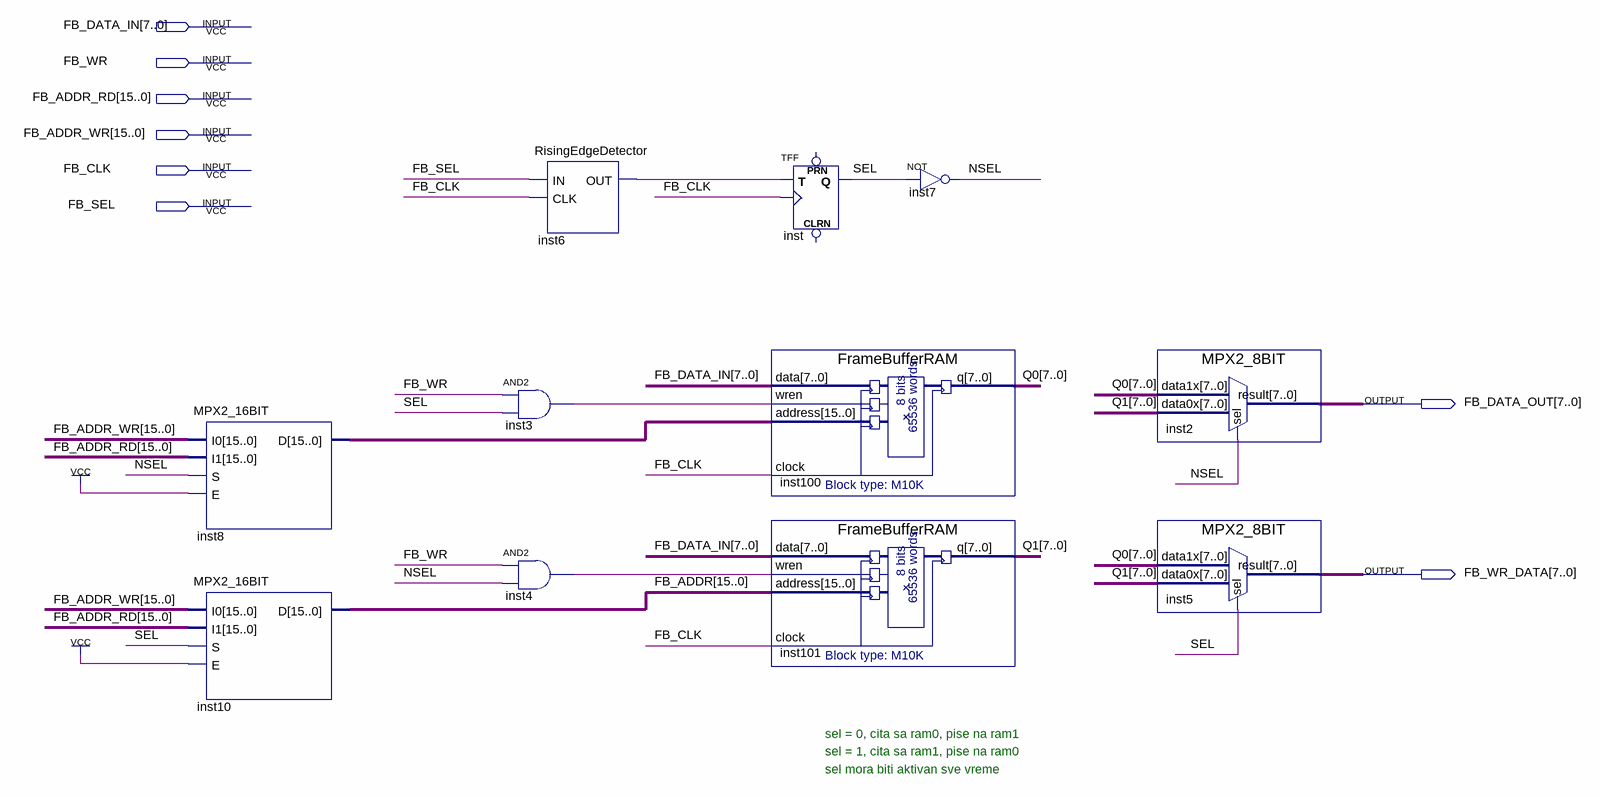
[diagram p0: schematic sheet]
// Quartus schematic FrameBufferWrapper.bdf as structural Verilog: 11 symbols, 8 pins
module FrameBufferWrapper (
  input  [7:0] FB_DATA_IN,
  input  FB_WR,
  input  [15:0] FB_ADDR_RD,
  input  [15:0] FB_ADDR_WR,
  input  FB_CLK,
  input  FB_SEL,
  output [7:0] FB_DATA_OUT,
  output [7:0] FB_WR_DATA
);

  wire inst3_out, inst4_out, inst6_out, NSEL, SEL;
  wire [7:0] Q0, Q1;
  wire [15:0] FB_ADDR, inst8_d;

  MPX2_16BIT inst8 (.I0(FB_ADDR_WR), .I1(FB_ADDR_RD), .S(NSEL), .E(1'b1), .D(inst8_d));
  MPX2_16BIT inst10 (.I0(FB_ADDR_WR), .I1(FB_ADDR_RD), .S(SEL), .E(1'b1), .D(FB_ADDR));
  and inst3 (inst3_out, FB_WR, SEL);
  and inst4 (inst4_out, FB_WR, NSEL);
  RisingEdgeDetector inst6 (.IN(FB_SEL), .CLK(FB_CLK), .OUT(inst6_out));
  TFF inst (.T(inst6_out), .CLK(FB_CLK), .Q(SEL));  // open: PRN, CLRN
  FrameBufferRAM inst100 (.data(FB_DATA_IN), .wren(inst3_out), .address(inst8_d), .clock(FB_CLK), .q(Q0));
  FrameBufferRAM inst101 (.data(FB_DATA_IN), .wren(inst4_out), .address(FB_ADDR), .clock(FB_CLK), .q(Q1));
  not inst7 (NSEL, SEL);
  MPX2_8BIT inst2 (.data1x(Q0), .data0x(Q1), .sel(NSEL), .result(FB_DATA_OUT));
  MPX2_8BIT inst5 (.data1x(Q0), .data0x(Q1), .sel(SEL), .result(FB_WR_DATA));

  // Notes on the sheet:
  //   sel = 0, cita sa ram0, pise na ram1
  //   sel = 1, cita sa ram1, pise na ram0
  //   sel mora biti aktivan sve vreme
endmodule
